# Altium schematic sheet P_A19_SmartPlugV2.SchDoc
size A3
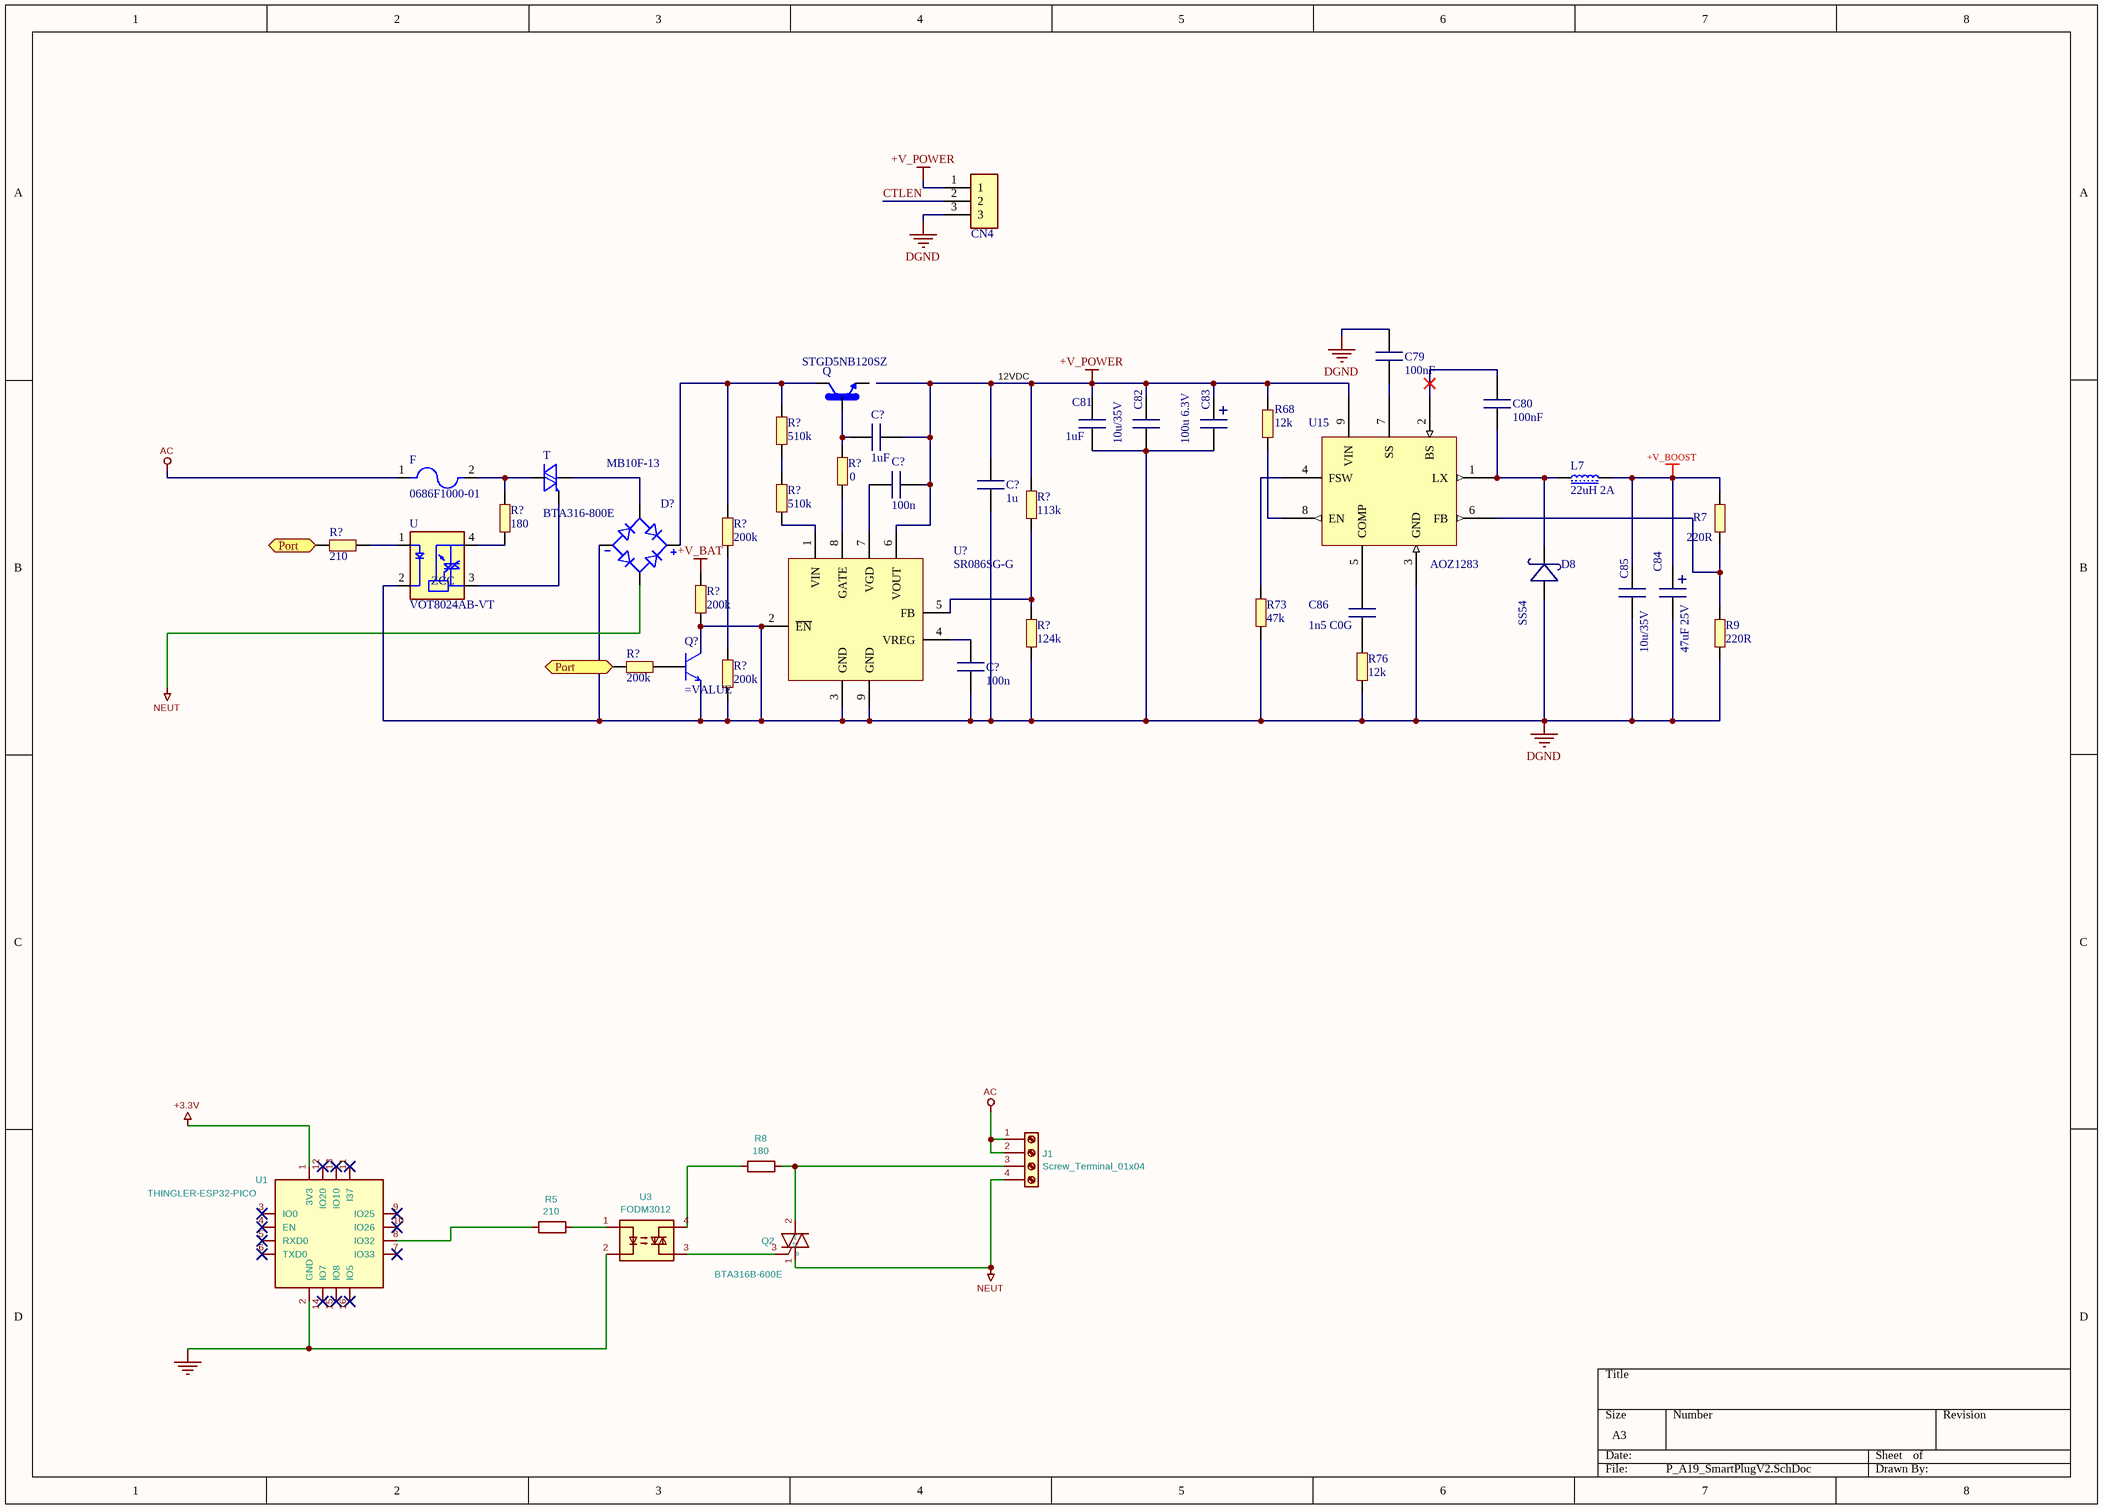
[diagram p0: P_A19_SmartPlugV2.SchDoc]

## Parts
(Parts that share a designator on the sheet are numbered #1, #2 ... from top to bottom, then left to right.)
C79  100nF  [CAP 0402]
C80  100nF  [CAP 0402]
C81  1uF  [CAP 0402]
C82  10u/35V  [CAP 0805]
C83  100u 6.3V  [CAP CASE D]
C84  47uF 25V  [CAP CASE D]
C85  10u/35V  [CAP 0805]
C86  1n5 C0G  [CAP 0805]
C?#1  1uF  [CAP 0603 1uF]
C?#2  100n  [CAP 0603 1uF]
C?#3  1u  [CAP 0603 1uF]
C?#4  100n  [CAP 0603 1uF]
CN4  [0503]THT_Hdr_Ma_3x1_0.1_ST  [[0503]THT_Hdr_Ma_3x1_0.1_ST]  (value not drawn)
D8  SS54  [SMC]
D?  MB10F-13  [DIOB_MB10F-13]
F  0686F1000-01  [FUSC1608X60N]
J1  Screw_Terminal_01x04  [3d_power_connector]
L7  22uH 2A  [MSS1038]
Q  STGD5NB120SZ  [DPAK]
Q2  BTA316B-600E  [to-263-2]
Q?  (no value)  [[0301]BC846B_SOT23]
R5  210  [R_1206_3216Metric_Pad1.42x1.75mm_HandSolder]
R7  220R  [RES 0603 220R]
R8  180  [R_1206_3216Metric_Pad1.42x1.75mm_HandSolder]
R9  220R  [RES 0603 220R]
R68  12k  [RES 0402]
R73  47k  [RES 0402]
R76  12k  [RES 0402]
R?#1  510k  [RES 0603 220R]
R?#2  0  [RES 0603 220R]
R?#3  510k  [RES 0603 220R]
R?#4  113k  [RES 0603 220R]
R?#5  180  [RES 0603 220R]
R?#6  200k  [RES 0603 220R]
R?#7  210  [RES 0603 220R]
R?#8  200k  [RES 0603 220R]
R?#9  124k  [RES 0603 220R]
R?#10  200k  [RES 0603 220R]
R?#11  200k  [RES 0603 220R]
T  BTA316-800E  [TO254P1530X430-3N]
U  VOT8024AB-VT  [SOIC254P1016X440-4N]
U1  THINGLER-ESP32-PICO  [Thingler-esp32-vertical]
U3  FODM3012  [FODM3012]
U15  AOZ1283  [EPAD-SO8]
U?  SR086SG-G  [EPAD-SO8]

## Ports
Port

## Nets
12VDC: C81.2 C82.2 C83.1 C?#1.2 C?#2.1 C?#3.1 CN4.1 R68.2 R?#4.2 U15.9(VIN) U?.6(VOUT)  [also labelled +V_POWER]
+3.3V: U1.1(3V3)
+V_BAT: R?#8.2
+V_BOOST: C84.1 C85.2 L7.2 R7.2
AC: F.1 J1.1(Pin_1) J1.2(Pin_2)
DGND: C79.2 C81.1 C82.1 C83.2 C84.2 C85.1 C?#3.2 C?#4.2 CN4.3 D8.1(A) D?.3(NEG) Q?.2(E) Q?.3(C) R9.2 R73.1 R76.1 R?#8.1 R?#9.1 R?#11.1 U.2(C) U15.3(GND) U?.2(~{EN}) U?.3(GND) U?.9(GND)
Earth: U1.2(GND) U3.2
NEUT: D?.2(AC1) J1.4(Pin_4) Q2.1(A1)
CTLEN: CN4.2
Port: R?#7.2 R?#10.2 ; port Port
NetC79_1: C79.1 U15.7(SS)
NetC80_1: C80.1 D8.2(C) L7.1 U15.1(LX)
NetC80_2: C80.2 U15.2(BS)
NetC86_1: C86.1 R76.2
NetC86_2: C86.2 U15.5(COMP)
NetC?#1_1: C?#1.1 Q.P$1(G) R?#2.2
NetC?#2_2: C?#2.2 U?.7(VGD)
NetC?#4_1: C?#4.1 U?.4(VREG)
NetD?_1: D?.1(POS) Q.P$2(C) R?#1.2 R?#6.2
NetD?_4: D?.4(AC2) T.T1(CM)
NetF_2: F.2 R?#5.1 T.T2(LD)
NetJ1_3: J1.3(Pin_3) Q2.2(A2) R8.1
NetQ2_3: Q2.3(G) U3.3
NetQ?_1: Q?.1(B) R?#10.1
NetR5_1: R5.1 U3.1
NetR5_2: R5.2 U1.8(IO32)
NetR7_1: R7.1 R9.1 U15.6(FB)
NetR8_2: R8.2 U3.4
NetR68_1: R68.1 U15.8(EN)
NetR73_2: R73.2 U15.4(FSW)
NetR?#1_1: R?#1.1 R?#3.2
NetR?#2_1: R?#2.1 U?.8(GATE)
NetR?#3_1: R?#3.1 U?.1(VIN)
NetR?#4_1: R?#4.1 R?#9.2 U?.5(FB)
NetR?#5_2: R?#5.2 U.4(MT2)
NetR?#6_1: R?#6.1 R?#11.2
NetR?#7_1: R?#7.1 U.1(A)
NetT_G: T.G U.3(MT1)

Not connected (* = marked no-connect by the designer): Q P$3(E); U1 3(IO0)* 4(EN)* 5(RXD0)* 6(TXD0)* 7(IO33)* 9(IO25)* 10(IO26)* 11(I37)* 12(IO20)* 13(IO10)* 14(IO7)* 15(IO8)* 16(IO5)*

## Notes on the sheet
- (in symbol VOT8024AB-VT) ZCC

## Library data of the parts
C79 C80 = CAP0402_100nF: Standard 0402 Capacitor, 5%, MLCC; UA P/N: 16-00; MN: YAGEO; MP: CC0402KRX7R7BB104; Value: 100nF; Footprint: 0402; Type: MLCC; Farnell: *; Mouser: *; DigiKey: *; LCSC: C60474; My_P/N: *
C81 = CAP0402_1uF: Standard 0402 Capacitor, 5%, MLCC; UA P/N: 16-00; MN: YAGEO; MP: CC0402KRX5R6BB105; Value: 1uF; Footprint: 0402; Type: MLCC; Farnell: *; Mouser: *; DigiKey: *; LCSC: C106254; My_P/N: *
C82 C85 = 10u/35V: Standard 0805 Capacitor; Type: X6R; Voltage: 35V; UA P/N: 16-0004; Value: 10u/35V; Footprint: 0805; Mounting: SMT
C83 = 100u 6.3V: Standard Case D Electrolytic Capacitor; Type: Al; UA P/N: 16-0025; Voltage: 6.3; Value: 100u 6.3V; Mounting: SMT
C84 = 47uF 25V: Standard Case D Electrolytic Capacitor; Type: AL; UA P/N: 16-0047; Value: 47uF 25V; Mounting: SMT
C86 = 1n5 C0G: Standard 0805 Capacitor; UA P/N: 16-0009; Voltage: 50V; Value: 1n5 C0G; Footprint: 0805; Type: C0G; Mounting: SMT
C?#1-C?#4 = CAP 0603 1uF: 16V 1uF X7R ±10% 0603 MLCC; MP: CS1608X7R105K160NRB; MN: Samwha Capacitor; Value: 1uF; Footprint: 0603; Tolerance: 10%; Dielectric: X7R; LCSC: C2918499
CN4 = [0503]THT_Hdr_Ma_3x1_0.1_ST: ThroughtHole Male Header 3x1 Pitch 0.1 Straight; Package: None; Price: None; Value: *; Availability: Unavailable
D8 = SS54: Shottky Diode in SMC package; Type: Schottky 5A 40V; UA P/N: 15-0029; Value: SS54; Mounting: SMT
D? = MB10F-13: Bridge Rectifier Single Phase Standard 1 kV Surface Mount MBF; MF: Diodes Inc.; Check_prices: https://www.snapeda.com/parts/MB10F-13/Diodes+Inc./view-part/?ref=eda; Value: *; Availability: In Stock; MP: MB10F-13; Price: None; Package: SMD-4 Diodes Inc.; SnapEDA_Link: https://www.snapeda.com/parts/MB10F-13/Diodes+Inc./view-part/?ref=snap; Purchase-URL: https://pricing.snapeda.com/search/part/MB10F-13/?ref=eda
F = 0686F1000-01: 0603 SMT Fuse | Fast Acting | 1A; MF: Bel Fuse; Mouser-Purchase-URL: https://snapeda.com/shop?store=Mouser&id=4616119; SnapEDA_Link: https://www.snapeda.com/parts/0686F1000-01/Bel%20Fuse/view-part/4616119/?ref=snap; Package: 0603 Bel Fuse Inc.; Price: None; MP: 0686F1000-01; Availability: Unavailable; Value: *
L7 = 22uH 2A: COILCRAFT MSS1038; UA P/N: 113-0003; Value: 22uH 2A; Type: MSS1038; Mounting: SMT
Q = STGD5NB120SZ: IGBT 1200V 10A 75W Surface Mount DPAK; MF: STMicroelectronics; Availability: Unavailable; Price: None; Package: TO-251-3 STMicroelectronics; Value: *; SnapEDA_Link: https://www.snapeda.com/parts/STGD5NB120SZ/STMicroelectronics/view-part/2878287/?ref=snap; MP: STGD5NB120SZ
Q2 = BT138-600: Value: BTA316B-600E; Footprint: smart-plug:to-263-2
Q? = NPN SOT-23: NPN SOT-23 transistor [0301]BC846B_SOT23
R5 R8 = R: Footprint: Resistor_SMD:R_1206_3216Metric_Pad1.42x1.75mm_HandSolder
  R5: Value: 210
  R8: Value: 180
R7 R9 = RES0603_220R: 1/10W ±1% 220Ω ±100ppm/℃ 0603; UA P/N: 13-0004; MP: CR0603F220RP05Z; MN: Ever Ohms Tech; Value: 220R; Footprint: 0603; Type: THICK FILM; LCSC: C881327; Price: US$0.0018
R68 R76 = RES0402_12k: Standard 0402 Resistor, 5%, Thick Film; UA P/N: 13-00; MN: YAGEO; MP: RC0402FR-0712KL; Value: 12k; Footprint: 0402; Type: THICK FILM; Farnell: *; Mouser: *; DigiKey: *; LCSC: C114760; My_P/N: *
R73 = RES0402_47k: Standard 0402 Resistor, 5%, Thick Film; UA P/N: 13-00; MN: YAGEO; MP: RC0402FR-0747KL; Value: 47k; Footprint: 0402; Type: THICK FILM; Farnell: *; Mouser: *; DigiKey: *; LCSC: C93943; My_P/N: *
R?#1-R?#11 = RES0603_220R: 1/10W ±1% 220Ω ±100ppm/℃ 0603; Value: 220R; UA P/N: 13-0004; MP: CR0603F220RP05Z; MN: Ever Ohms Tech; Footprint: 0603; Type: THICK FILM; LCSC: C881327; Price: US$0.0018
T = BTA316-800E: TRIAC Logic - Sensitive Gate 800V 16A Through Hole TO-220AB; MF: WeEn Semiconductors; Availability: Unavailable; Price: None; Package: TO-220 WeEn Semiconductors; MP: BTA316-800E; Value: *; SnapEDA_Link: https://www.snapeda.com/parts/BTA316-800E/WeEn%20Semiconductors/view-part/4449646/?ref=snap
U = VOT8024AB-VT: Optoisolator Triac Output 5300Vrms 1 Channel 4-SMD; MF: Vishay Semiconductor; Price: None; Package: SMD-4 Vishay Semiconductor; Value: *; MP: VOT8024AB-VT; Availability: Unavailable; SnapEDA_Link: https://www.snapeda.com/parts/VOT8024AB-VT/Vishay%20Semiconductor%20Opto%20Division/view-part/4219083/?ref=snap
U15 = AOZ1283: UA P/N: 15-0006; Value: AOZ1283; Type: 36V 2.5A Buck Regulator; DigiKey PN: AOZ1283PI-ND; Mounting: SMT
U? = SR086SG-G: T SR086SG-G _ /RADJUSTABLE OFF-LINE INDUCTORLESS SWITCHING REGULATOR | Microchip Technology Inc.; UA P/N: 15-0006; Value: SR086SG-G; Type: 36V 2.5A Buck Regulator; DigiKey PN: SR086SG-G
J1 = Screw_Terminal_01x04: Value: Screw_Terminal_01x04; Footprint: smart-plug:3d_power_connector
U1 = THINGLER-ESP32-PICO: Value: THINGLER-ESP32-PICO; Footprint: smart-plug:Thingler-esp32-vertical
U3 = FODM3012: Value: FODM3012; Footprint: smart-plug:FODM3012